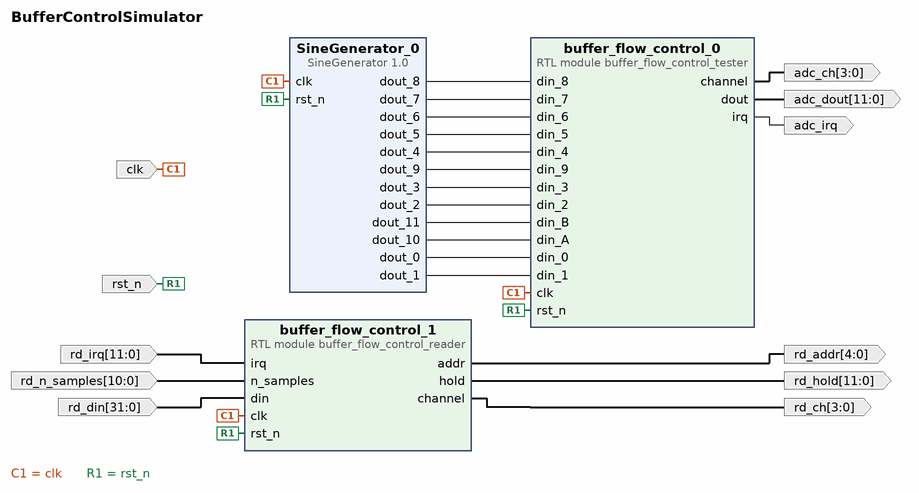
[diagram p0: block diagram of the top level]
# Vivado block design BufferControlSimulator, xczu3eg-sbva484-1-i, Vivado 2020.2
create_bd_design BufferControlSimulator

create_bd_port -dir I -type clk clk
create_bd_port -dir O -type intr adc_irq
create_bd_port -dir O -from 11 -to 0 adc_dout
create_bd_port -dir O -from 3 -to 0 adc_ch
create_bd_port -dir O -from 11 -to 0 rd_hold
create_bd_port -dir O -from 4 -to 0 rd_addr
create_bd_port -dir O -from 3 -to 0 rd_ch
create_bd_port -dir I -from 11 -to 0 -type intr rd_irq
set_property -dict {CONFIG.PortWidth 12} [get_bd_ports rd_irq]
create_bd_port -dir I -from 10 -to 0 rd_n_samples
create_bd_port -dir I -from 31 -to 0 rd_din
create_bd_port -dir I -type rst rst_n

create_bd_cell -type module -reference buffer_flow_control_tester buffer_flow_control_0
create_bd_cell -type ip -vlnv DIII:PL-Mag-Sensor:SineGenerator:1.0 SineGenerator_0
create_bd_cell -type module -reference buffer_flow_control_reader buffer_flow_control_1

# ---- connections ----

connect_bd_net -net clk_0_1 [get_bd_ports clk] \
  [get_bd_pins buffer_flow_control_0/clk] [get_bd_pins SineGenerator_0/clk] [get_bd_pins buffer_flow_control_1/clk]
connect_bd_net [get_bd_pins buffer_flow_control_0/irq] [get_bd_ports adc_irq]
connect_bd_net [get_bd_pins buffer_flow_control_0/dout] [get_bd_ports adc_dout]
connect_bd_net [get_bd_pins buffer_flow_control_0/channel] [get_bd_ports adc_ch]
connect_bd_net [get_bd_pins buffer_flow_control_1/hold] [get_bd_ports rd_hold]
connect_bd_net [get_bd_pins buffer_flow_control_1/addr] [get_bd_ports rd_addr]
connect_bd_net [get_bd_pins buffer_flow_control_1/channel] [get_bd_ports rd_ch]
connect_bd_net -net irq_0_1 [get_bd_ports rd_irq] [get_bd_pins buffer_flow_control_1/irq]
connect_bd_net -net n_samples_0_1 [get_bd_ports rd_n_samples] [get_bd_pins buffer_flow_control_1/n_samples]
connect_bd_net -net din_0_1 [get_bd_ports rd_din] [get_bd_pins buffer_flow_control_1/din]
connect_bd_net -net rst_n_0_1 [get_bd_ports rst_n] \
  [get_bd_pins buffer_flow_control_0/rst_n] [get_bd_pins SineGenerator_0/rst_n] [get_bd_pins buffer_flow_control_1/rst_n]
connect_bd_net [get_bd_pins SineGenerator_0/dout_8] [get_bd_pins buffer_flow_control_0/din_8]
connect_bd_net [get_bd_pins SineGenerator_0/dout_7] [get_bd_pins buffer_flow_control_0/din_7]
connect_bd_net [get_bd_pins SineGenerator_0/dout_6] [get_bd_pins buffer_flow_control_0/din_6]
connect_bd_net [get_bd_pins SineGenerator_0/dout_5] [get_bd_pins buffer_flow_control_0/din_5]
connect_bd_net [get_bd_pins SineGenerator_0/dout_4] [get_bd_pins buffer_flow_control_0/din_4]
connect_bd_net [get_bd_pins SineGenerator_0/dout_9] [get_bd_pins buffer_flow_control_0/din_9]
connect_bd_net [get_bd_pins SineGenerator_0/dout_3] [get_bd_pins buffer_flow_control_0/din_3]
connect_bd_net [get_bd_pins SineGenerator_0/dout_2] [get_bd_pins buffer_flow_control_0/din_2]
connect_bd_net [get_bd_pins SineGenerator_0/dout_11] [get_bd_pins buffer_flow_control_0/din_B]
connect_bd_net [get_bd_pins SineGenerator_0/dout_10] [get_bd_pins buffer_flow_control_0/din_A]
connect_bd_net [get_bd_pins SineGenerator_0/dout_0] [get_bd_pins buffer_flow_control_0/din_0]
connect_bd_net [get_bd_pins SineGenerator_0/dout_1] [get_bd_pins buffer_flow_control_0/din_1]

validate_bd_design
save_bd_design
